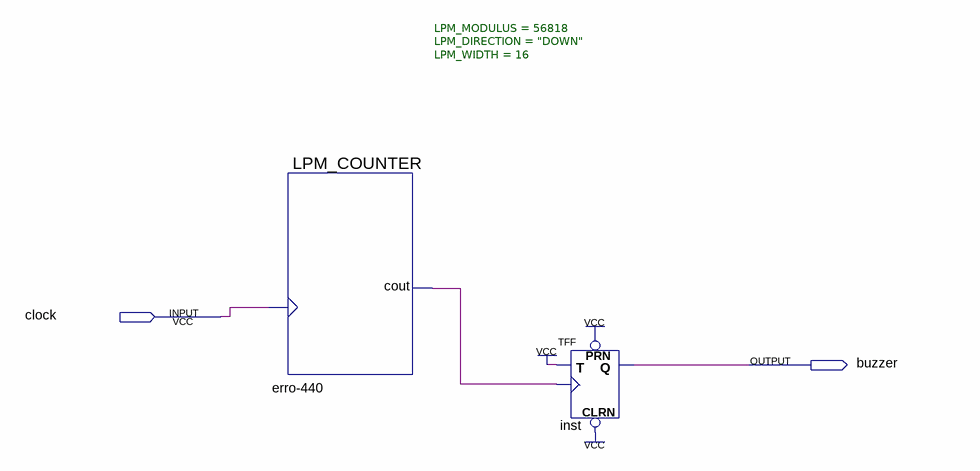
[diagram p0: schematic sheet]
// Quartus schematic teste_drive.bdf as structural Verilog: 2 symbols, 2 pins
module teste_drive (
  input  clock,
  output buzzer
);

  wire erro_440_cout;

  LPM_COUNTER #(.LPM_MODULUS(56818), .LPM_DIRECTION("DOWN"), .LPM_WIDTH(16)) \erro-440  (
    .clock(clock), .cout(erro_440_cout));
  TFF inst (.PRN(1'b1), .CLRN(1'b1), .T(1'b1), .CLK(erro_440_cout), .Q(buzzer));
endmodule
